# EAGLE schematic display_buttons (EAGLE 6.4)
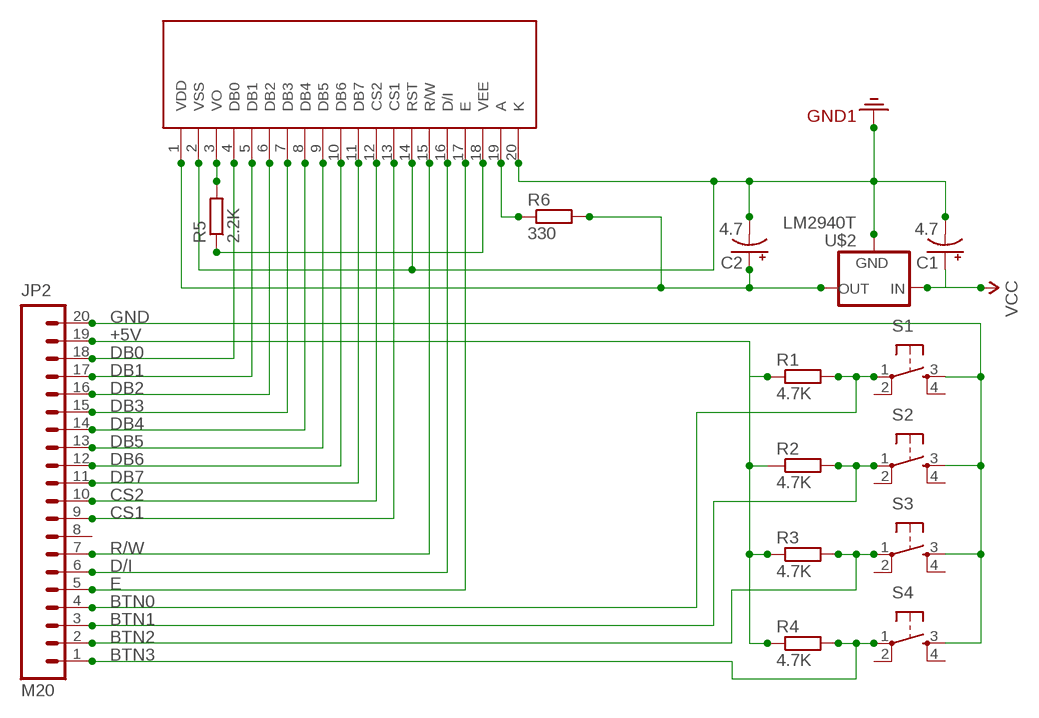
[diagram p0: schematic, sheet 1]

## Parts
C1  4.7  CAP_POLPTH2  [CPOL-RADIAL-10UF-25V]
C2  4.7  CAP_POLPTH2  [CPOL-RADIAL-10UF-25V]
JP2  M20  [1X20]
R1  4.7K  R-EU_0204/7  [0204/7]
R2  4.7K  R-EU_0204/7  [0204/7]
R3  4.7K  R-EU_0204/7  [0204/7]
R4  4.7K  R-EU_0204/7  [0204/7]
R5  2.2K  R-EU_0204/7  [0204/7]
R6  330  R-EU_0204/7  [0204/7]
S1  TAC_SWITCHPTH  [TACTILE-PTH]
S2  TAC_SWITCHPTH  [TACTILE-PTH]
S3  TAC_SWITCHPTH  [TACTILE-PTH]
S4  TAC_SWITCHPTH  [TACTILE-PTH]
U$1  LCD-G12864FULL  [LCD-G12864]
U$2  LM2940T  V_REG_LD1117VXX  [78XXL]

## Nets
3.3V: C1.2(-) C2.2(-) U$1.2(VSS) U$1.14(RST) U$1.20(K) U$2.IN(GND) ; supply symbol labelled GND2
+5V: JP2.19 R1.1 R2.1 R3.1 R4.1
BTN0: JP2.4 R1.2 S1.1
BTN1: JP2.3 R2.2 S2.1
BTN2: JP2.2 R3.2 S3.1
BTN3: JP2.1 R4.2 S4.1
CS1: JP2.9 U$1.13(CS1)
CS2: JP2.10 U$1.12(CS2)
D/I: JP2.6 U$1.16(D/I)
DB0: JP2.18 U$1.4(DB0)
DB1: JP2.17 U$1.5(DB1)
DB2: JP2.16 U$1.6(DB2)
DB3: JP2.15 U$1.7(DB3)
DB4: JP2.14 U$1.8(DB4)
DB5: JP2.13 U$1.9(DB5)
DB6: JP2.12 U$1.10(DB6)
DB7: JP2.11 U$1.11(DB7)
E: JP2.5 U$1.17(E)
GND: JP2.20 S1.3 S2.3 S3.3 S4.3
N$6: C2.1(+) R6.2 U$1.1(VDD) U$2.GND(OUT)
N$10: R5.2 U$1.3(VO)
N$13: R5.1 U$1.18(VEE)
N$14: R6.1 U$1.19(A)
R/W: JP2.7 U$1.15(R/W)
VCC: C1.1(+) U$2.OUT(IN)
Unconnected: JP2.8 S1.2 S1.4 S2.2 S2.4 S3.2 S3.4 S4.2 S4.4

## Library data of the parts
C1 C2 = SparkFun-Capacitors:CAP_POL: Capacitor Polarized These are standard SMD and PTH capacitors. Normally 10uF, 47uF, and 100uF in electrolytic and tantalum varieties. Always verify the external diameter of the through hole cap, it varies with capacity, voltage, and manufacturer. The EIA devices should be standard.
JP2 = SparkFun-Connectors:M20: 1x20 .1" header This is just like the LOCK variant in that the holes are staggared by 5 mil, but except for the last two holes. They are not altered from the "standard" footprint layout. This is used for a special purpose on the layout of our Graphic LCD Backpack. Make sure you want to use this device before selecting it for you project!
R1-R6 = resistor:R-EU_: RESISTOR, European symbol
S1-S4 = SparkFun-Electromechanical:TAC_SWITCH: Momentary Switch Button commonly used for reset or general input. Spark Fun Electronics SKU : COM-00097 SMT- SWCH-08247
U$1 = SparkFun-Displays:LCD-G12864: Graphical LCD 128x64 Footprint is not yet proven. Double check it. Spark Fun Electronics SKU : LCD-00710
U$2 = SparkFun-PowerIC:V_REG_LD1117VXX: LD1117VXX voltage regulator. We carry the 3.3V version (COM-00526) in TO-220 package.